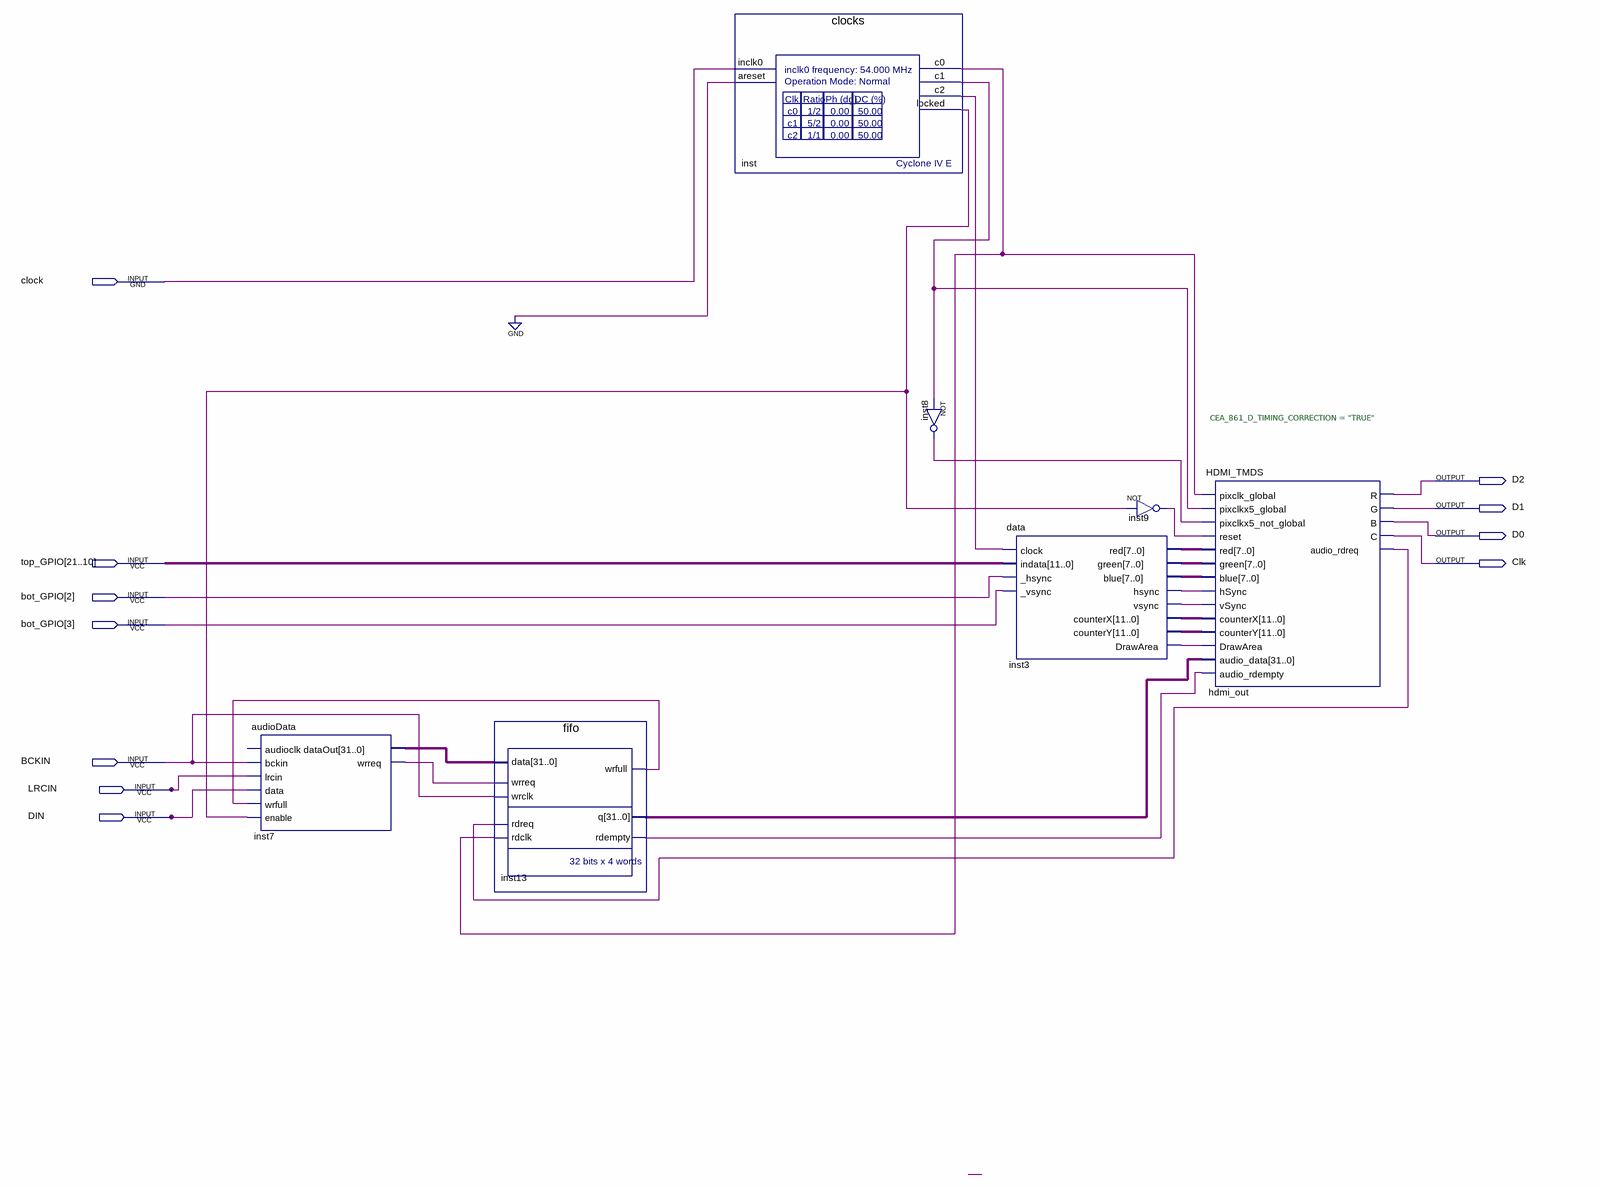
[diagram p0: schematic sheet]
// Quartus schematic Top.bdf as structural Verilog: 7 symbols, 11 pins
module Top (
  input  clock,
  input  [21:10] top_GPIO,
  input  [3:2] bot_GPIO,
  input  BCKIN,
  input  LRCIN,
  input  DIN,
  output D2,
  output D1,
  output D0,
  output Clk
);

  wire hdmi_out_audio_rdreq, inst3_drawarea, inst3_hsync, inst3_vsync, inst7_wrreq, inst8_out, inst9_out,
       inst13_rdempty, inst13_wrfull, inst_c0, inst_c1, inst_c2, inst_locked;
  wire [7:0] inst3_blue, inst3_green, inst3_red;
  wire [11:0] inst3_counterx, inst3_countery;
  wire [31:0] inst7_dataout, inst13_q;

  audioData inst7 (
    .bckin(BCKIN), .lrcin(LRCIN), .data(DIN), .wrfull(inst13_wrfull), .enable(inst_locked),
    .dataOut(inst7_dataout), .wrreq(inst7_wrreq));  // open: audioclk
  fifo inst13 (
    .data(inst7_dataout), .wrreq(inst7_wrreq), .wrclk(BCKIN), .rdreq(hdmi_out_audio_rdreq), .rdclk(inst_c0),
    .wrfull(inst13_wrfull), .q(inst13_q), .rdempty(inst13_rdempty));
  clocks inst (.inclk0(clock), .areset(1'b0), .c0(inst_c0), .c1(inst_c1), .c2(inst_c2), .locked(inst_locked));
  not inst8 (inst8_out, inst_c1);
  data #(.CEA_861_D_TIMING_CORRECTION("TRUE")) inst3 (
    .clock(inst_c2), .indata(top_GPIO), ._hsync(bot_GPIO[2]), ._vsync(bot_GPIO[3]), .red(inst3_red),
    .green(inst3_green), .blue(inst3_blue), .hsync(inst3_hsync), .vsync(inst3_vsync),
    .counterX(inst3_counterx), .counterY(inst3_countery), .DrawArea(inst3_drawarea));
  not inst9 (inst9_out, inst_locked);
  HDMI_TMDS hdmi_out (
    .pixclk_global(inst_c0), .pixclkx5_global(inst_c1), .pixclkx5_not_global(inst8_out), .reset(inst9_out),
    .red(inst3_red), .green(inst3_green), .blue(inst3_blue), .hSync(inst3_hsync), .vSync(inst3_vsync),
    .counterX(inst3_counterx), .counterY(inst3_countery), .DrawArea(inst3_drawarea), .audio_data(inst13_q),
    .audio_rdempty(inst13_rdempty), .R(D2), .G(D1), .B(D0), .C(Clk), .audio_rdreq(hdmi_out_audio_rdreq));
endmodule
